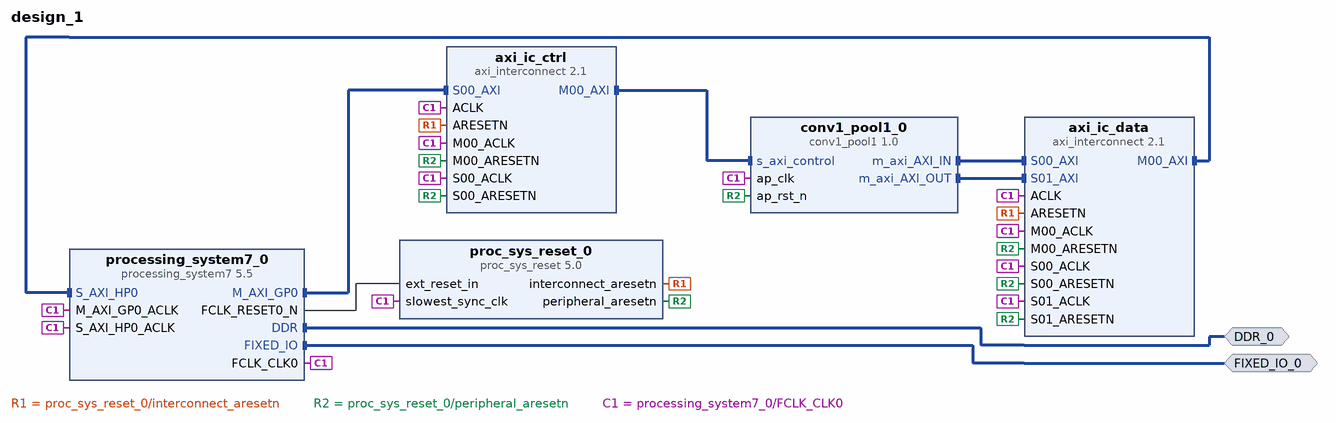
[diagram p0: block diagram of the top level]
# Vivado block design design_1, xc7z020clg400-1, Vivado 2024.2
create_bd_design design_1

create_bd_intf_port -mode Master -vlnv xilinx.com:interface:ddrx_rtl:1.0 DDR_0
create_bd_intf_port -mode Master -vlnv xilinx.com:display_processing_system7:fixedio_rtl:1.0 FIXED_IO_0

create_bd_cell -type ip -vlnv xilinx.com:ip:processing_system7:5.5 processing_system7_0
set_property -dict {CONFIG.PCW_FPGA0_PERIPHERAL_FREQMHZ 100 CONFIG.PCW_USE_S_AXI_HP0 1} [get_bd_cells processing_system7_0]
# 35 more settings of processing_system7_0 are not shown: defaults, MIO pin electricals, DDR timing, and values the tool derives
create_bd_cell -type ip -vlnv xilinx.com:ip:proc_sys_reset:5.0 proc_sys_reset_0
create_bd_cell -type ip -vlnv user:hls:conv1_pool1:1.0 conv1_pool1_0
create_bd_cell -type ip -vlnv xilinx.com:ip:axi_interconnect:2.1 axi_ic_ctrl
set_property -dict {CONFIG.NUM_MI 1 CONFIG.NUM_SI 1} [get_bd_cells axi_ic_ctrl]
create_bd_cell -type ip -vlnv xilinx.com:ip:axi_interconnect:2.1 axi_ic_data
set_property -dict {CONFIG.NUM_MI 1 CONFIG.NUM_SI 2} [get_bd_cells axi_ic_data]

# ---- connections ----

connect_bd_intf_net [get_bd_intf_pins axi_ic_ctrl/M00_AXI] [get_bd_intf_pins conv1_pool1_0/s_axi_control]
connect_bd_intf_net [get_bd_intf_pins axi_ic_data/M00_AXI] [get_bd_intf_pins processing_system7_0/S_AXI_HP0]
connect_bd_intf_net [get_bd_intf_pins conv1_pool1_0/m_axi_AXI_IN] [get_bd_intf_pins axi_ic_data/S00_AXI]
connect_bd_intf_net [get_bd_intf_pins conv1_pool1_0/m_axi_AXI_OUT] [get_bd_intf_pins axi_ic_data/S01_AXI]
connect_bd_intf_net [get_bd_intf_ports DDR_0] [get_bd_intf_pins processing_system7_0/DDR]
connect_bd_intf_net [get_bd_intf_ports FIXED_IO_0] [get_bd_intf_pins processing_system7_0/FIXED_IO]
connect_bd_intf_net [get_bd_intf_pins processing_system7_0/M_AXI_GP0] [get_bd_intf_pins axi_ic_ctrl/S00_AXI]
connect_bd_net [get_bd_pins proc_sys_reset_0/interconnect_aresetn] [get_bd_pins axi_ic_ctrl/ARESETN] [get_bd_pins axi_ic_data/ARESETN]
connect_bd_net [get_bd_pins proc_sys_reset_0/peripheral_aresetn] \
  [get_bd_pins axi_ic_ctrl/S00_ARESETN] [get_bd_pins axi_ic_ctrl/M00_ARESETN] [get_bd_pins axi_ic_data/S00_ARESETN] \
  [get_bd_pins axi_ic_data/S01_ARESETN] [get_bd_pins axi_ic_data/M00_ARESETN] [get_bd_pins conv1_pool1_0/ap_rst_n]
connect_bd_net [get_bd_pins processing_system7_0/FCLK_CLK0] \
  [get_bd_pins processing_system7_0/M_AXI_GP0_ACLK] [get_bd_pins processing_system7_0/S_AXI_HP0_ACLK] \
  [get_bd_pins proc_sys_reset_0/slowest_sync_clk] [get_bd_pins axi_ic_ctrl/ACLK] [get_bd_pins axi_ic_ctrl/S00_ACLK] \
  [get_bd_pins axi_ic_ctrl/M00_ACLK] [get_bd_pins axi_ic_data/ACLK] [get_bd_pins axi_ic_data/S00_ACLK] \
  [get_bd_pins axi_ic_data/S01_ACLK] [get_bd_pins axi_ic_data/M00_ACLK] [get_bd_pins conv1_pool1_0/ap_clk]
connect_bd_net [get_bd_pins processing_system7_0/FCLK_RESET0_N] [get_bd_pins proc_sys_reset_0/ext_reset_in]

# ---- address map ----
assign_bd_address -offset 0x0000000000000000 -range 512M -target_address_space [get_bd_addr_spaces conv1_pool1_0/Data_m_axi_AXI_IN] [get_bd_addr_segs processing_system7_0/S_AXI_HP0/HP0_DDR_LOWOCM]
assign_bd_address -offset 0x0000000000000000 -range 512M -target_address_space [get_bd_addr_spaces conv1_pool1_0/Data_m_axi_AXI_OUT] [get_bd_addr_segs processing_system7_0/S_AXI_HP0/HP0_DDR_LOWOCM]
assign_bd_address -offset 0x40000000 -range 64K -target_address_space [get_bd_addr_spaces processing_system7_0/Data] [get_bd_addr_segs conv1_pool1_0/s_axi_control/Reg]

validate_bd_design
save_bd_design
